# EAGLE design mubi-bot-3 (EAGLE 7.2.0)
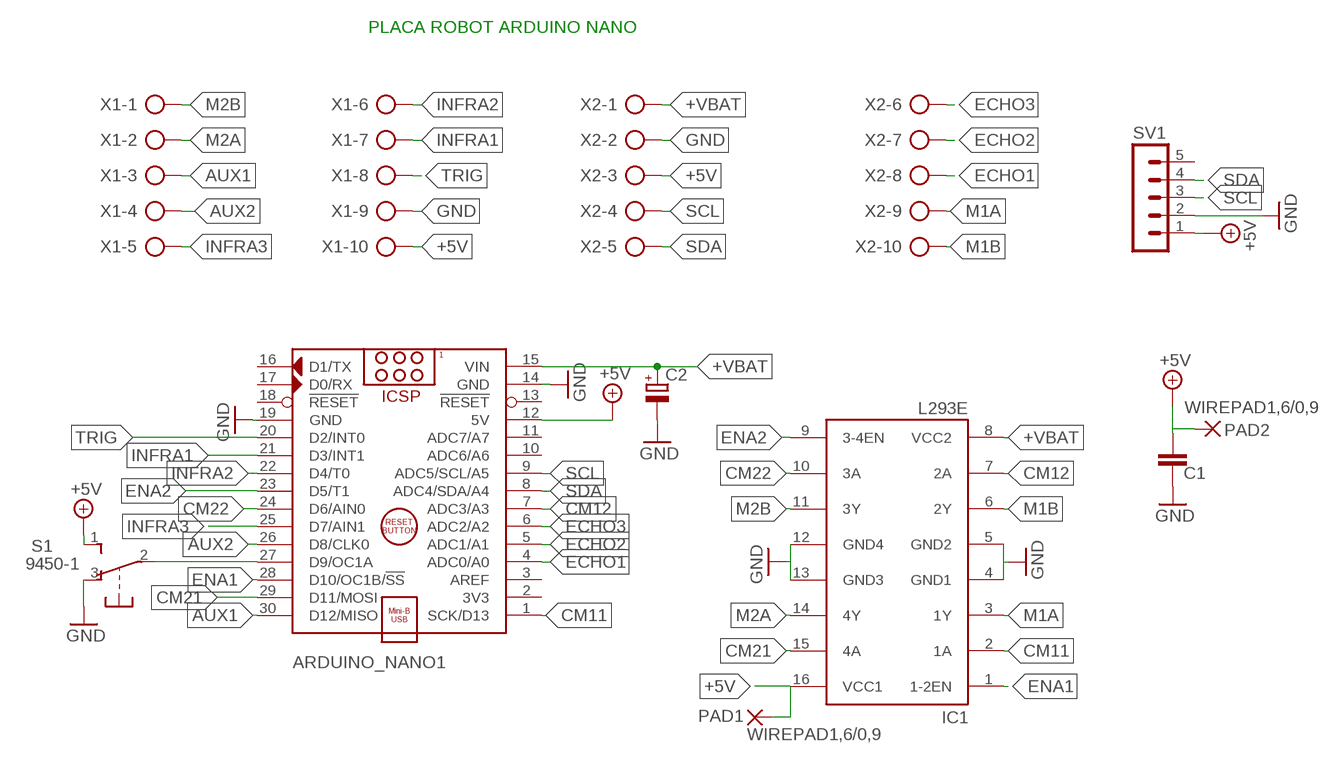
[diagram p0: schematic, sheet 1]

## Parts
ARDUINO_NANO1  ARDUINO_NANO  [ARDUINO_NANO]
C1  C-EU050-025X075  [C050-025X075]
C2  CPOL-EUE2.5-5  [E2,5-5]
IC1  L293E  [DIL16]
PAD1  WIREPAD1,6/0,9  [1,6/0,9]
PAD2  WIREPAD1,6/0,9  [1,6/0,9]
S1  9450-1  [9450-1]
SV1  MA05-1  [MA05-1]
X1  AK500/10-H  [AK500/10-H]
X2  AK500/10-H  [AK500/10-H]

## Nets
+5V: ARDUINO_NANO1.12(5V) C1.1 IC1.16(VCC1) PAD1.1(P) PAD2.1(P) S1.1(S) SV1.1 X1.10 X2.3
+VBAT: ARDUINO_NANO1.15(VIN) C2.+ IC1.8(VCC2) X2.1
AUX1: ARDUINO_NANO1.30(D12/MISO) X1.3
AUX2: ARDUINO_NANO1.26(D8/CLK0) X1.4
CM11: ARDUINO_NANO1.1(SCK/D13) IC1.2(1A)
CM12: ARDUINO_NANO1.7(ADC3/A3) IC1.7(2A)
CM21: ARDUINO_NANO1.29(D11/MOSI) IC1.15(4A)
CM22: ARDUINO_NANO1.24(D6/AIN0) IC1.10(3A)
ECHO1: ARDUINO_NANO1.4(ADC0/A0) X2.8
ECHO2: ARDUINO_NANO1.5(ADC1/A1) X2.7
ECHO3: ARDUINO_NANO1.6(ADC2/A2) X2.6
ENA1: ARDUINO_NANO1.28(D10/OC1B/!SS) IC1.1(1-2EN)
ENA2: ARDUINO_NANO1.23(D5/T1) IC1.9(3-4EN)
GND: ARDUINO_NANO1.14(GND) ARDUINO_NANO1.19(GND) C1.2 C2.- IC1.12(GND4) IC1.13(GND3) S1.3(O) SV1.2 X1.9 X2.2
INFRA1: ARDUINO_NANO1.21(D3/INT1) X1.7
INFRA2: ARDUINO_NANO1.22(D4/T0) X1.6
INFRA3: ARDUINO_NANO1.25(D7/AIN1) X1.5
M1A: IC1.3(1Y) X2.9
M1B: IC1.6(2Y) X2.10
M2A: IC1.14(4Y) X1.2
M2B: IC1.11(3Y) X1.1
N$1: IC1.4(GND1) IC1.5(GND2) ; supply symbol labelled GND
N$2: ARDUINO_NANO1.27(D9/OC1A) S1.2(P)
SCL: ARDUINO_NANO1.9(ADC5/SCL/A5) SV1.3 X2.4
SDA: ARDUINO_NANO1.8(ADC4/SDA/A4) SV1.4 X2.5
TRIG: ARDUINO_NANO1.20(D2/INT0) X1.8
Unconnected: ARDUINO_NANO1.2(3V3) ARDUINO_NANO1.3(AREF) ARDUINO_NANO1.10(ADC6/A6) ARDUINO_NANO1.11(ADC7/A7) ARDUINO_NANO1.13(!RESET) ARDUINO_NANO1.16(D1/TX) ARDUINO_NANO1.17(D0/RX) ARDUINO_NANO1.18(!RESET) SV1.5

## Notes on the sheet
- PLACA ROBOT ARDUINO NANO

## Library data of the parts
ARDUINO_NANO1 = ArduinoNanoV30:ARDUINO_NANO: Arduino Nano V3.0 Module Overview: The Arduino Nano is a small, complete, and breadboard-friendly board based on the ATmega328 (Arduino Nano 3.x) or ATmega168 (Arduino Nano 2.x). It has more or less the same functionality of the Arduino Duemilanove, but in a different package. It lacks only a DC power jack, and works with a Mini-B USB cable instead of a standard one. The Nano was designed and is being produced by Gravitech <http://www.gravitech.us/arna30wiatp.html>. General specifications: Item Value Microcontroller Atmel ATmega168 or ATmega328 Operating Voltage (logic level) 5 V Input Voltage (recommended) 7-12 V Input Voltage (limits) 6-20 V Digital I/O Pins 14 (of which 6 provide PWM output) Analog Input Pins 8 DC Current per I/O Pin 40 mA Flash Memory 16 KB (ATmega168) or 32 KB (ATmega328) of which 2 KB used by bootloader SRAM 1 KB (ATmega168) or 2 KB (ATmega328) EEPROM 512 bytes (ATmega168) or 1 KB (ATmega328) Clock Speed 16 MHz Dimensions (Inches) 0.73" x 1.70" Dimensions (mm) 18mm x 45mm Overall height About 9 mm (not including pins) Weigth 5 g Power: The Arduino Nano can be powered via the Mini-B USB connection, 6-20V unregulated external power supply (pin 30), or 5V regulated external power supply (pin 27). The power source is automatically selected to the highest voltage source. Memory: The ATmega168 has 16 KB of flash memory for storing code (of which 2 KB is used for the bootloader); the ATmega328 has 32 KB, (also with 2 KB used for the bootloader). The ATmega168 has 1 KB of SRAM and 512 bytes of EEPROM (which can be read and written with the EEPROM library); the ATmega328 has 2 KB of SRAM and 1 KB of EEPROM. Input and Output: Each of the 14 digital pins on the Nano can be used as an input or output, using pinMode(), digitalWrite(), and digitalRead() functions. They operate at 5 volts. Each pin can provide or receive a maximum of 40 mA and has an internal pull-up resistor (disconnected by default) of 20-50 kOhms. In addition, some pins have specialized functions. Visit Arduino - ArduinoBoardNano <https://www.arduino.cc/en/Main/ArduinoBoardNano>
C1 = resistor:C-EU: CAPACITOR, European symbol
C2 = resistor:CPOL-EU: POLARIZED CAPACITOR, European symbol
IC1 = texas:L293E: TI DEVICE; MF: Arrow Electronics; MPN: L293E; OC_FARNELL: 1467711; OC_NEWARK: 89K0732
PAD1 PAD2 = wirepad:WIREPAD: Wire PAD connect wire on PCB
S1 = switch-misc:9450-1: MARQUARDT SWITCH
SV1 = con-lstb:MA05-1: PIN HEADER; OC_FARNELL: unknown; OC_NEWARK: unknown
X1 X2 = con-ptr500:AK500/10-H: CONNECTOR Aug. 2004 / PTR Meßtechnik: Die Bezeichnung der Serie AK505 wurde geändert. Es handelt sich hierbei um AK500 in horizontaler Ausführung.; OC_FARNELL: unknown; OC_NEWARK: unknown

## Net classes
0 default: clearance 0.205 mm

## Board
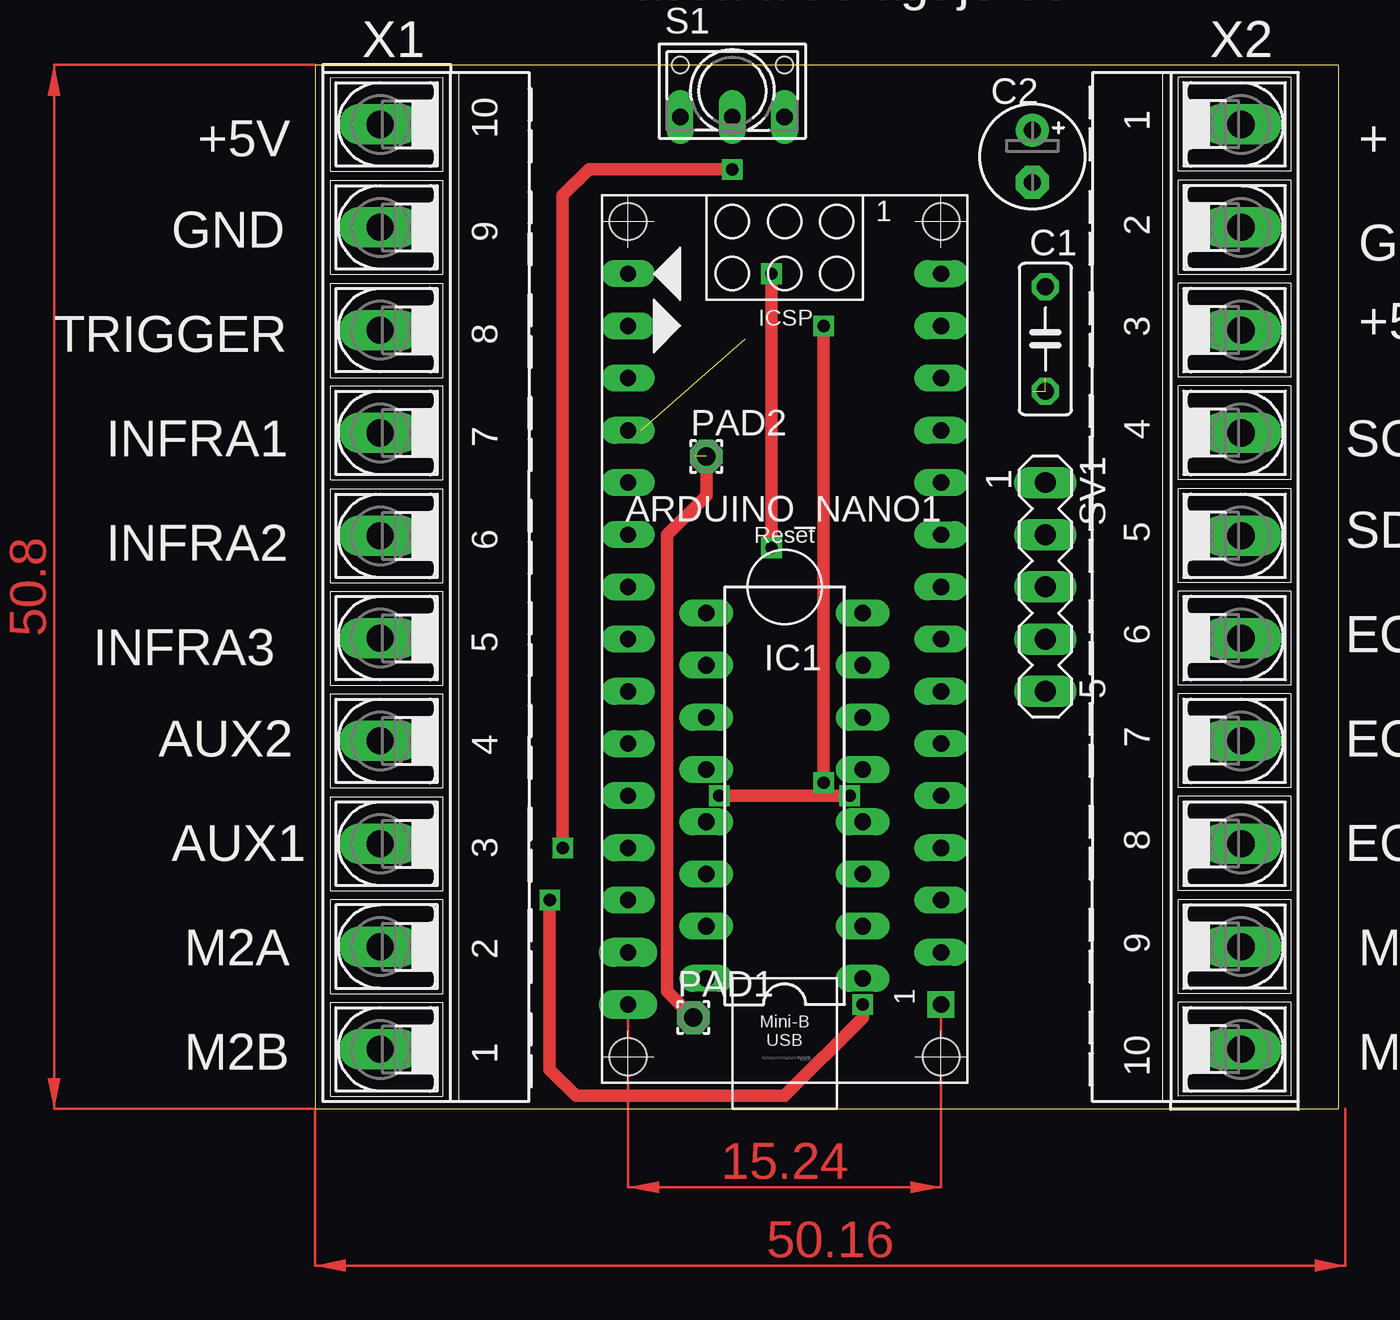
[diagram p1: board, top side]
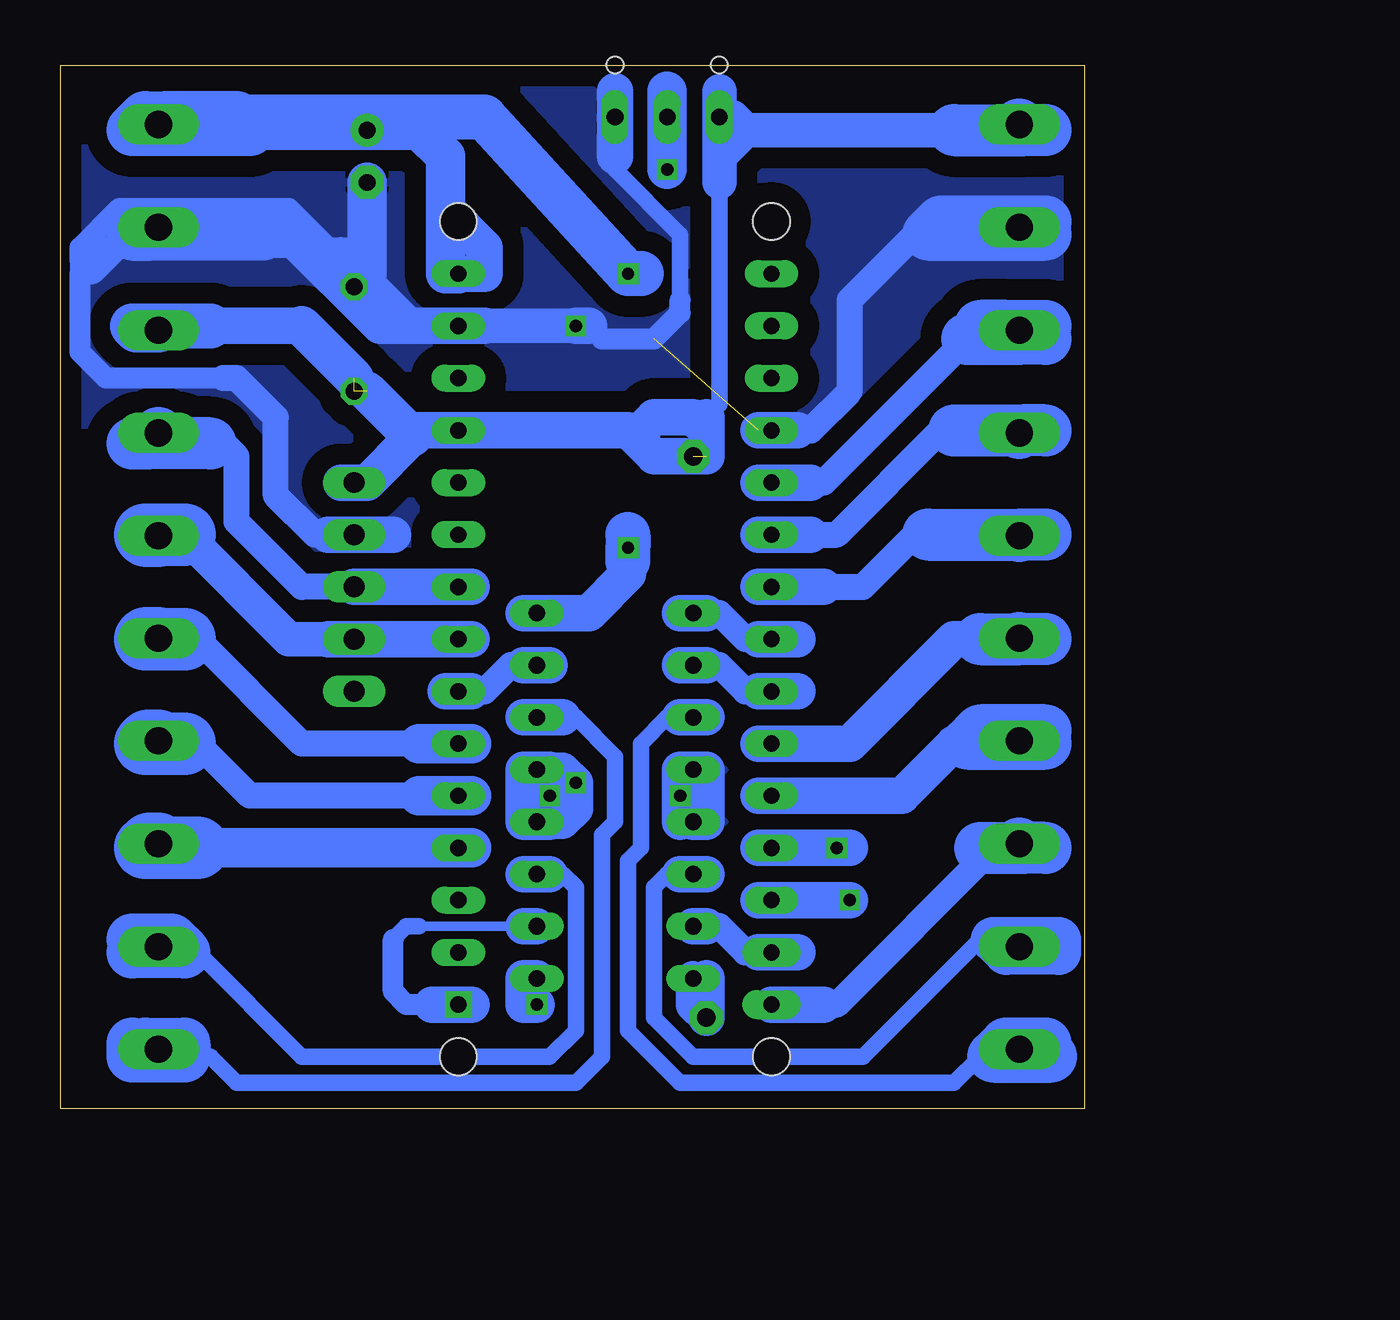
[diagram p2: board, bottom side, seen from below]

Size 49.84 x 50.79 mm. Coordinates in mm from the lower left corner, seen from the top.
Outline: 0,0 49.84,0 49.84,50.79 0,50.79 0,0
Copper layers (1*16): Top 0.035mm / dielectric 1.5mm / Bottom 0.035mm
Design rules "default": minimum track width 10mil, minimum drill 24mil, track to track 8mil, track to pad 8mil, pad to pad 8mil, via to via 8mil, smd to smd 8mil, copper to edge 40mil, drill to drill 8mil, minimum pad ring 10mil, minimum via ring 8mil, stop-mask expansion 4mil, vias tented up to drill 0mil, thermal gap 10mil

### Footprints (pad centres in the part's own frame; a part is rotated, then mirrored left to right if it is on the bottom)
ARDUINO_NANO = drill 0.8 pad 1.27 square: 1 -20.32,-7.62 | drill 0.8 long: 2 -17.78,-7.62; 3 -15.24,-7.62; 4 -12.7,-7.62; 5 -10.16,-7.62; 6 -7.62,-7.62; 7 -5.08,-7.62; 8 -2.54,-7.62; 9 0,-7.62; 10 2.54,-7.62; 11 5.08,-7.62; 12 7.62,-7.62; 13 10.16,-7.62; 14 12.7,-7.62; 15 15.24,-7.62; 16 15.24,7.62; 17 12.7,7.62; 18 10.16,7.62; 19 7.62,7.62; 20 5.08,7.62; 21 2.54,7.62; 22 0,7.62; 23 -2.54,7.62; 24 -5.08,7.62; 25 -7.62,7.62; 26 -10.16,7.62; 27 -12.7,7.62; 28 -15.24,7.62 | drill 0.8 pad 1.422 long: 29 -17.78,7.62; 30 -20.32,7.62 | hole 1.778: -22.86,-7.62; -22.86,7.62; 17.78,7.62; 17.78,-7.62
C050-025X075 = drill 0.813 octagon: 1 -2.54,0; 2 2.54,0
E2,5-5 = drill 0.813 pad 1.6: + -1.27,0 | drill 0.813 pad 1.6 octagon: - 1.27,0
DIL16 = drill 0.813 long: 1 -8.89,-3.81; 2 -6.35,-3.81; 3 -3.81,-3.81; 4 -1.27,-3.81; 5 1.27,-3.81; 6 3.81,-3.81; 7 6.35,-3.81; 8 8.89,-3.81; 9 8.89,3.81; 10 6.35,3.81; 11 3.81,3.81; 12 1.27,3.81; 13 -1.27,3.81; 14 -3.81,3.81; 15 -6.35,3.81; 16 -8.89,3.81
1,6/0,9 = drill 0.914 pad 1.6 octagon: 1 0,0
9450-1 = drill 0.813 long: 1 -2.54,-1.27; 2 0,-1.27; 3 2.54,-1.27 | hole 0.813: 2.54,1.27; -2.54,1.27
MA05-1 = drill 1.016 long: 1 -5.08,0; 2 -2.54,0; 3 0,0; 4 2.54,0; 5 5.08,0
AK500/10-H = drill 1.321 long: 1 -22.504,0; 2 -17.501,0; 3 -12.497,0; 4 -7.493,0; 5 -2.489,0; 6 2.489,0; 7 7.493,0; 8 12.497,0; 9 17.501,0; 10 22.504,0

### Placement (x,y rotation side)
ARDUINO_NANO1  22.86,25.4 90 top
C1  35.56,37.47 90 top
C2  34.92,46.35 270 top
IC1  22.86,15.24 90 top
PAD1  18.41,4.45 0 top
PAD2  19.05,31.75 0 top
S1  20.32,49.53 0 top
SV1  35.56,25.4 270 top
X1  3.17,25.4 90 top
X2  45.09,25.4 270 top

### Tracks (layer width: path | path; a pad name or v marks a point on that pad's centre or on a via)
+5V  (3 unrouted)
  Top 0.61: PAD2.1 19.05,29.84 17.14,27.94 17.14,5.71 PAD1.1
  Bottom 0.813: 19.05,33.02 18.41,33.66 17.78,34.29 17.78,45.09
  Bottom 1.676: 17.78,45.09 17.78,46.35 | 17.78,46.35 S1.1 | 17.78,49.53 S1.1 | S1.1 17.14,48.26 16.51,47.62 | 17.78,46.35 16.51,47.62 | 16.51,47.62 6.35,47.62 | IC1.16 19.05,5.08 PAD1.1
  Bottom 1.778: 36.2,30.48 SV1.1 34.92,30.48 32.7,32.7 32.38,33.02 | 42.55,38.1 38.1,38.1 | 18.41,6.35 PAD1.1 | 33.02,33.02 ARDUINO_NANO1.12 22.23,33.02 20.95,31.75 18.41,31.75 18.41,33.02 | 18.41,33.02 18.41,33.66 | 18.41,33.02 19.05,33.66 20.95,33.66 21.59,33.02
  Bottom 1.93: 35.56,35.56 38.1,38.1 | 34.92,34.92 33.02,33.02 32.7,32.7
  Bottom 2.184: X2.3 46.15,37.9 46.35,38.1 42.55,38.1
  Bottom 2.54: 6.35,47.62 2.9,47.62 | 1.91,47.62 2.9,47.62 | 2.9,47.62 X1.10
+VBAT  (via drill 0.6)
  Top 0.61: v22.23,27.3 v22.23,40.64
  Bottom 1.778: 27.3,24.13 IC1.8 24.13,24.13 22.23,26.04 22.23,26.67 | ARDUINO_NANO1.15 29.21,40.64 29.21,41.91 31.11,43.81
  Bottom 1.93: 40.64,47.62 C2.+ 32.38,47.62 31.11,46.35 31.11,43.81 31.11,40.64 ARDUINO_NANO1.15
  Bottom 2.184: 21.59,40.64 v22.23,40.64 29.21,48.26 41.27,48.26 | 22.23,26.67 v22.23,27.3 22.23,27.94
  Bottom 2.54: 40.64,47.62 46.35,47.62 45.72,48.26 44.73,48.26 | 41.27,48.26 44.73,48.26 | 44.73,48.26 X2.1
AUX1
  Bottom 1.27: 12.7,5.08 12.06,5.08 4.45,12.7
  Bottom 1.778: ARDUINO_NANO1.30 12.7,5.08
  Bottom 2.54: 5.08,12.7 4.45,12.7 2.97,12.7 | 1.91,12.7 2.97,12.7 | 2.97,12.7 X1.3
AUX2
  Bottom 1.778: 15.88,15.24 ARDUINO_NANO1.26 8.89,15.24 6.35,17.78 5.71,17.78 5.08,17.78
  Bottom 2.54: 5.08,17.78 1.91,17.78 1.91,18.41 5.08,18.41 5.71,17.78 3.3,17.78 X1.4
CM11
  Bottom 0.406: IC1.2 28.57,8.89
  Bottom 0.457: 32.38,8.89 28.57,8.89 27.94,8.89
  Bottom 0.813: 33.66,8.26 33.02,8.89 32.38,8.89
  Bottom 1.016: 31.75,5.08 33.02,5.08 33.66,5.71 33.66,8.26
  Bottom 1.778: 31.75,5.08 ARDUINO_NANO1.1 29.84,5.08 | 27.3,8.89 IC1.2
CM12
  Bottom 1.27: 29.84,20.32 29.21,20.32 27.94,21.59 27.3,21.59
  Bottom 1.778: 31.11,20.32 ARDUINO_NANO1.7 29.84,20.32 | 27.3,21.59 IC1.7 26.04,21.59
CM21
  Bottom 1.27: 18.41,8.89 17.78,8.89 16.51,7.62 15.88,7.62
  Bottom 1.778: IC1.15 18.41,8.89 | 15.88,7.62 ARDUINO_NANO1.29 13.97,7.62
CM22
  Bottom 1.27: 15.88,20.32 16.51,20.32 17.78,21.59 18.41,21.59
  Bottom 1.778: 13.97,20.32 ARDUINO_NANO1.24 15.88,20.32 | 18.41,21.59 IC1.10 19.68,21.59
ECHO1
  Bottom 1.93: 29.84,12.7 ARDUINO_NANO1.4 43.81,12.7
  Bottom 3.048: X2.8 45.52,12.9 45.72,12.7 43.81,12.7 43.18,12.7
ECHO2
  Bottom 1.27: 32.38,15.24 40.64,15.24 43.18,17.78 44.45,17.78
  Bottom 1.93: 29.84,15.24 ARDUINO_NANO1.5 32.38,15.24
  Bottom 3.048: X2.7 45.59,17.91 45.72,17.78 44.45,17.78 43.81,17.78
ECHO3
  Bottom 1.27: 32.38,17.78 38.1,17.78 43.18,22.86 44.45,22.86
  Bottom 1.93: 29.84,17.78 ARDUINO_NANO1.6 32.38,17.78
  Bottom 3.048: X2.6 45.67,22.91 45.72,22.86 44.45,22.86 43.81,22.86
ENA1  (via drill 0.6)
  Top 0.61: v11.43,10.16 11.43,1.91 12.7,0.64 22.86,0.64 26.67,4.45 v26.67,5.08
  Bottom 1.778: 15.88,10.16 ARDUINO_NANO1.28 v11.43,10.16 | IC1.1 27.3,6.35 27.3,5.08 v26.67,5.08
ENA2
  Bottom 1.27: 18.41,24.13 17.78,24.13 16.51,22.86 15.88,22.86
  Bottom 1.778: 19.68,24.13 IC1.9 18.41,24.13 | 15.88,22.86 ARDUINO_NANO1.23 13.97,22.86
GND  (via drill 0.6)  (1 unrouted)
  Top 0.61: v19.68,15.24 24.77,15.24 | 24.77,15.24 v26.04,15.24 | v24.77,38.1 24.77,15.24
  Bottom 0.813: 19.68,39.37 19.68,42.55 22.86,45.72 22.86,46.35
  Bottom 1.016: 41.91,35.56 47.62,35.56 48.9,36.83 48.9,40.64 | 48.9,41.27 48.9,41.91 46.99,43.81 38.73,43.81 36.83,41.91 | 36.2,41.91 35.56,41.91 | 36.83,41.91 48.26,41.91 48.9,41.27 | 48.9,41.27 48.9,40.64 | 48.9,40.64 48.26,40.64 46.35,42.55 | 36.83,41.91 36.2,41.91 | 36.2,41.91 32.38,38.1 33.66,38.1 C1.2 | 24.13,38.1 23.5,37.47 20.95,37.47 19.68,38.73 19.68,39.37
  Bottom 1.27: 13.97,33.02 13.34,33.02 11.43,34.92 11.43,39.37 8.26,42.55 7.62,42.55 | 36.83,27.94 37.47,27.94 39.37,29.84 39.37,33.66 41.27,35.56 41.91,35.56
  Bottom 1.676: 29.21,38.1 v24.77,38.1
  Bottom 1.778: IC1.13 18.41,13.97 18.41,16.51 19.68,16.51 v19.68,15.24 19.68,13.97 | 33.66,27.94 SV1.2 36.83,27.94 | 29.21,38.1 ARDUINO_NANO1.14 32.38,38.1 34.29,38.1 38.73,42.55 40.01,42.55 | 15.88,33.02 ARDUINO_NANO1.19 13.97,33.02 | v24.77,38.1 24.13,38.1 | 22.86,46.35 S1.3 22.86,49.53 | 26.04,16.51 27.3,16.51 27.3,13.97 26.04,13.97 v26.04,15.24 26.04,16.51
  Bottom 1.93: 34.92,39.37 C1.2 36.2,40.64 34.92,40.64 C2.-
  Bottom 2.54: 40.01,42.55 45.44,42.55 | 46.35,42.55 45.44,42.55 | 45.44,42.55 X2.2 | 3.53,42.55 1.91,42.55 1.91,43.18 6.99,43.18 7.62,42.55 3.53,42.55 | 3.53,42.55 X1.9
  pour Bottom (isolate 1.016): 50.16,0 1.27,0 0,50.8 50.16,50.8
INFRA1
  Bottom 1.27: 13.34,27.94 12.06,27.94 6.99,33.02 6.35,33.02
  Bottom 1.778: 15.88,27.94 ARDUINO_NANO1.21 13.34,27.94
  Bottom 2.54: 6.35,33.02 3.05,33.02 | 1.91,33.02 3.05,33.02 | 3.05,33.02 X1.7
INFRA2
  Bottom 1.27: 12.7,25.4 10.79,25.4 8.26,27.94 7.62,27.94
  Bottom 1.778: 15.88,25.4 ARDUINO_NANO1.22 12.7,25.4
  Bottom 2.54: 7.62,27.94 3.12,27.94 | 1.91,27.94 3.12,27.94 | 3.12,27.94 X1.6
INFRA3
  Bottom 1.778: 15.88,17.78 ARDUINO_NANO1.25 11.43,17.78 6.35,22.86 5.08,22.86
  Bottom 2.54: 5.08,22.86 3.12,22.86 | 1.91,22.86 3.12,22.86 | 3.12,22.86 X1.5
M1A
  Bottom 0.813: 26.04,11.43 25.4,11.43 24.77,10.79 24.77,3.81 26.04,2.54 38.1,2.54 43.18,7.62 46.35,7.62
  Bottom 1.778: 27.3,11.43 IC1.3 26.04,11.43
  Bottom 2.54: X2.9 46,7.9 46.35,8.26 44.45,8.26 43.81,7.62 46.35,7.62
M1B
  Bottom 0.813: 46.35,2.54 42.55,2.54 41.27,1.27 24.77,1.27 23.5,2.54 23.5,13.34 22.86,13.97 22.86,17.14 24.77,19.05 25.4,19.05
  Bottom 1.778: 27.3,19.05 IC1.6 25.4,19.05
  Bottom 2.54: X2.10 46.08,2.9 46.35,3.17 46.35,2.54 | 46.35,2.54 45.72,3.17 43.81,3.17 43.81,2.54 46.35,2.54
M2A
  Bottom 0.813: 19.68,11.43 20.32,11.43 20.95,10.79 20.95,4.45 19.05,2.54 10.79,2.54 5.08,8.26 4.45,8.26 3.81,8.26
  Bottom 1.778: 18.41,11.43 IC1.14 19.68,11.43
  Bottom 2.184: 3.81,8.26 1.27,8.26 1.27,7.62 3.81,7.62 4.45,8.26 1.63,8.26 X1.2
M2B
  Bottom 0.813: 19.68,19.05 20.32,19.05 21.59,17.78 21.59,12.7 22.23,12.06 22.23,3.81 19.68,1.27 6.35,1.27 5.08,2.54 4.45,2.54
  Bottom 1.778: 18.41,19.05 IC1.11 19.68,19.05
  Bottom 2.54: 1.91,2.54 1.91,3.17 3.81,3.17 4.45,2.54 1.91,2.54 | 1.91,2.54 1.63,2.54 X1.1
N$1  (via drill 0.6)
  Bottom 1.676: IC1.4 25.4,13.97 24.77,14.61 v24.77,15.88 25.4,16.51 IC1.5
N$2  (via drill 0.6)
  Top 0.61: v20.32,45.72 13.34,45.72 12.06,44.45 v12.06,12.7
  Bottom 1.778: 15.88,12.7 ARDUINO_NANO1.27 v12.06,12.7 11.43,12.7
  Bottom 1.93: 20.32,49.53 S1.2 v20.32,45.72
SCL
  Bottom 1.27: SV1.3 38.1,25.4 41.27,28.57 41.27,31.75 41.91,32.38 42.55,32.38
  Bottom 1.778: SV1.3 ARDUINO_NANO1.9 29.84,25.4
  Bottom 2.54: 42.55,32.38 45.59,32.38 | 46.35,32.38 45.59,32.38 | 45.59,32.38 X2.4
SDA
  Bottom 1.676: 36.83,22.86 38.73,22.86 43.81,27.94
  Bottom 1.778: 36.83,22.86 SV1.4 ARDUINO_NANO1.8 29.84,22.86
  Bottom 3.048: X2.5 45.67,27.89 45.72,27.94 43.81,27.94
TRIG
  Bottom 1.27: 13.34,30.48 12.7,30.48 5.71,37.47
  Bottom 1.778: 15.88,30.48 ARDUINO_NANO1.20 13.34,30.48
  Bottom 2.54: 5.71,37.47 3.17,37.47 | 1.91,37.47 3.17,37.47 | 3.17,37.47 3.81,38.1 | 3.38,38.1 1.91,38.1 | 3.81,38.1 5.08,38.1 | 3.81,38.1 3.38,38.1 | 3.38,38.1 X1.8
(copper drawn outside any net)
  shapes: Top area x3

### Text on the board
tNames: mascara de agujeros | +5V | + VBAT | GND | GND | TRIGGER | +5V | INFRA1 | SCL | INFRA2 | SDA | INFRA3 | ECHO3 | ECHO3 | AUX2 | ECHO2 | ECHO2 | AUX1 | ECHO1 | M2A | M1A | M2B | M1B